# Altium schematic sheet Master.SchDoc
size A4; SheetNumber: 2; SheetTotal: 7
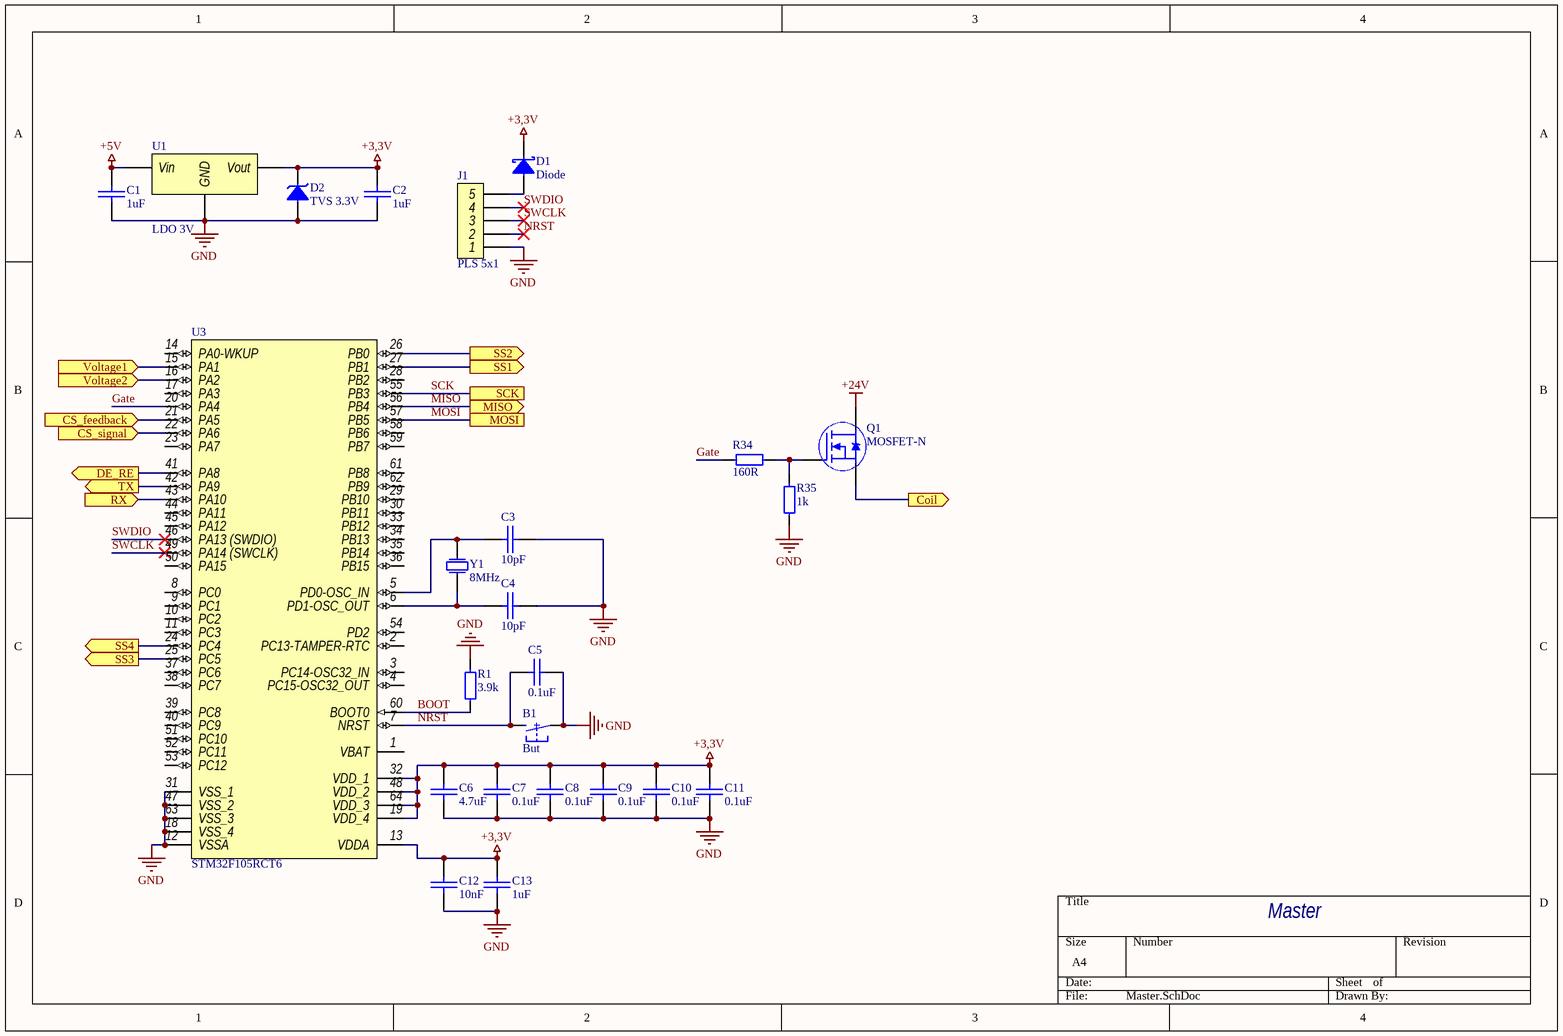
[diagram p0: Master.SchDoc]

## Parts
B1  But  [BUTTON 6x3.5]
C1  1uF  [0603 Capicator]
C2  1uF  [0603 Capicator]
C3  10pF  [0603 Capicator]
C4  10pF  [0603 Capicator]
C5  0.1uF  [0603 Capicator]
C6  4.7uF  [0603 Capicator]
C7  0.1uF  [0603 Capicator]
C8  0.1uF  [0603 Capicator]
C9  0.1uF  [0603 Capicator]
C10  0.1uF  [0603 Capicator]
C11  0.1uF  [0603 Capicator]
C12  10nF  [0603 Capicator]
C13  1uF  [0603 Capicator]
D1  Diode  [sod-123]
D2  TVS 3.3V  [DO-216AA]
J1  PLS 5x1  [PLS 5x1]
Q1  MOSFET-N  [SOT-23]
R1  3.9k  [0603 Resistor]
R34  160R  [0603 Resistor]
R35  1k  [0603 Resistor]
U1  LDO 3V  [SOT-23]
U3  STM32F105RCT6  [LQFP64]
Y1  8MHz  [NX5032GA]

## Ports
Coil (out), CS_feedback (in), CS_signal (in), DE_RE (out), MISO (out), MOSI, RX (in), SCK, SS1 (out), SS2 (out), SS3 (out), SS4 (out), TX (out), Voltage1 (in), Voltage2 (in)

## Nets
+3,3V: C2.2 C6.2 C7.2 C8.2 C9.2 C10.2 C11.2 C12.2 C13.2 D1.2 D2.2 U1.2(Vout) U3.13(VDDA) U3.19(VDD_4) U3.32(VDD_1) U3.48(VDD_2) U3.64(VDD_3)
+5V: C1.2 U1.3(Vin)
+24V: Q1.3(Drain)
GND: B1.1 C1.1 C2.1 C3.2 C4.2 C5.2 C6.1 C7.1 C8.1 C9.1 C10.1 C11.1 C12.1 C13.1 D2.1 J1.1 R1.2 R35.1 U1.1(GND) U3.12(VSSA) U3.18(VSS_4) U3.31(VSS_1) U3.47(VSS_2) U3.63(VSS_3)
BOOT: R1.1 U3.60(BOOT0)
Coil: Q1.2(Source) ; port Coil
CS_feedback: U3.21(PA5) ; port CS_feedback
CS_signal: U3.22(PA6) ; port CS_signal
DE_RE: U3.41(PA8) ; port DE_RE
Gate: R34.1 U3.20(PA4)
MISO: U3.56(PB4) ; port MISO
MOSI: U3.57(PB5) ; port MOSI
NRST: B1.2 C5.1 J1.2 U3.7(NRST)
RX: U3.43(PA10) ; port RX
SCK: U3.55(PB3) ; port SCK
SS1: U3.27(PB1) ; port SS1
SS2: U3.26(PB0) ; port SS2
SS3: U3.25(PC5) ; port SS3
SS4: U3.24(PC4) ; port SS4
SWCLK: J1.3 U3.49(PA14_(SWCLK))
SWDIO: J1.4 U3.46(PA13_(SWDIO))
TX: U3.42(PA9) ; port TX
Voltage1: U3.15(PA1) ; port Voltage1
Voltage2: U3.16(PA2) ; port Voltage2
NetC3_1: C3.1 U3.5(PD0-OSC_IN) Y1.2
NetC4_1: C4.1 U3.6(PD1-OSC_OUT) Y1.1
NetD1_1: D1.1 J1.5
NetQ1_1: Q1.1(Gate) R34.2 R35.2

Not connected (* = marked no-connect by the designer): U3 1(VBAT) 2(PC13-TAMPER-RTC) 3(PC14-OSC32_IN) 4(PC15-OSC32_OUT) 8(PC0) 9(PC1) 10(PC2) 11(PC3) 14(PA0-WKUP) 17(PA3) 23(PA7) 28(PB2) 29(PB10) 30(PB11) 33(PB12) 34(PB13) 35(PB14) 36(PB15) 37(PC6) 38(PC7) 39(PC8) 40(PC9) 44(PA11) 45(PA12) 50(PA15) 51(PC10) 52(PC11) 53(PC12) 54(PD2) 58(PB6) 59(PB7) 61(PB8) 62(PB9)

## Notes on the sheet
- Master

## Library data of the parts
B1 = Button 2 Conn: Button 2 Conn SMD; Part Number: L-KLS7-TS3608-5.0-180; Manufacturer: KLS electronic co ltd; Type: Button; ComponentLink1Description: Chip&Dip; ComponentLink1URL: https://www.chipdip.ru/product/kls7-ts3608-5.0-180-td-02xa
C1 C2 C13 = Cap 1uF (0603): 1uF X5R 25V 10% 0603; Manufacturer: Murata Manufacturing; Part Number: GRM188R61E105KAADD; Type: Capacitor; ComponentLink1Description: Chip&Dip; ComponentLink1URL: https://www.chipdip.ru/product/grm188r61e105k
C3 C4 = Cap 10pF (0603): 10pF NP0 50V 5% 0603; Manufacturer: Murata Manufacturing; Part Number: GRM1885C1H100JA01D; Type: Capacitor; ComponentLink1Description: Chip&Dip; ComponentLink1URL: https://www.chipdip.ru/product/grm1885c1h100j
C5 C7-C11 = Cap 0.1uF (0603): 0.1uF X7R 16V 10% 0603; Manufacturer: Murata Manufacturing; Part Number: GRM188R71C104KA01D; Type: Capacitor; ComponentLink1Description: Chip&Dip; ComponentLink1URL: https://www.chipdip.ru/product/grm188r71c104ka01d
C6 = Cap 4.7uF (0603): 4.7uF X5R 25V 10% 0603; Manufacturer: Murata Manufacturing; Part Number: GRM188R61E475KE11D; Type: Capacitor; ComponentLink1Description: Chip&Dip; ComponentLink1URL: https://www.chipdip.ru/product0/9000348448
C12 = Cap 10nF (0603): 10nF X7R  100V 10% 0603; Manufacturer: Murata Manufacturing; Part Number: GRM188R72A103KA01D; Type: Capacitor; ComponentLink1Description: Chip&Dip; ComponentLink1URL: https://www.chipdip.ru/product/grm188r72a103ka01d
D1 = Diode Schottky (SOD-123): 0.5 A, Low Forward Voltage less than 385 mV, 400 mW Power Dissipation Package; Part Number: MBR0520L; Manufacturer: ON Semiconductor; Type: Diode; ComponentLink1Description: DataSheet; ComponentLink1URL: http://www.farnell.com/datasheets/1875336.pdf; ComponentLink2Description: Chip&Dip; ComponentLink2URL: https://www.chipdip.ru/product/mbr0520l
D2 = TVS Diode 3.3V [SM2T]: High peak pulse power: 200 W (10/1000 μs); Part Number: SM2T3V3A; Manufacturer: STMicroelectronics; Type: Diode; ComponentLink1Description: DataSheet; ComponentLink1URL: https://www.st.com/resource/en/datasheet/sm2t3v3a.pdf; ComponentLink2Description: Chip&Dip; ComponentLink2URL: https://www.chipdip.ru/product0/8283670575
J1 = Conn 5 (PLS): Header, 5-Pin
Q1 = MOSFET-N [IRLML]: VDS 30V,  VGS Max ± 20V, RDS 27-40mΩ,; Part Number: IRLML0030TRPBF; Manufacturer: Infineon Technologies; Type: Transistor; ComponentLink1Description: DataSheet; ComponentLink1URL: https://static.chipdip.ru/lib/300/DOC000300382.pdf; ComponentLink2Description: Chip&Dip; ComponentLink2URL: https://www.chipdip.ru/product/irlml0030trpbf
R1 = Res 3.9k (0603): 0.1W 0603 3.9k, 1%; Part Number: RC0603FR-073K9L; Manufacturer: Taiwan; Type: Resistor; ComponentLink1Description: Chip&Dip; ComponentLink1URL: https://www.chipdip.ru/product0/9000079726
R34 = Res 160R (0603): 0.1W 0603 160R, 1%; Part Number: RC0603FR-07160RL; Manufacturer: Taiwan; Type: Resistor; ComponentLink1Description: Chip&Dip; ComponentLink1URL: https://www.chipdip.ru/product/0.1w-0603-160-om-1
R35 = Res 1k (0603): 0.1W 0603 1k, 1%; Part Number: RC0603FR-071KL; Manufacturer: Taiwan; Type: Resistor; ComponentLink1Description: Chip&Dip; ComponentLink1URL: https://www.chipdip.ru/product0/9000079676
U1 = LDO 3,3V [MCP]: MCP1702 Low Dropout Voltage Regulator. The input operating range is specifiedfrom 2.7V to 13.2V; Part Number: MCP1702T-3002E/CB; Manufacturer: Microchip; ComponentLink1Description: DataSheet; ComponentLink1URL: https://static.chipdip.ru/lib/986/DOC003986671.pdf; ComponentLink2Description: Chip&Dip; ComponentLink2URL: https://www.chipdip.ru/product/mcp1702t-3002e-cb-microchip
U3 = STM32F105RCT6: MCU ARM 256KB FLASH MEM 64-LQFP; Manufacturer: STMicroelectronics; Part Number: STM32F105RCT6; ComponentLink1Description: DataSheet; ComponentLink1URL: https://static.chipdip.ru/lib/375/DOC011375072.pdf; ComponentLink2Description: Chip&Dip; ComponentLink2URL: https://www.chipdip.ru/product/stm32f105rct6; Type: IC
Y1 = Crystal 8MHz: Crystal NX5032GA; Manufacturer: Nihon Dempa Kogio (NDK); Part Number: NX5032GA-8MHz; Type: Crystal; ComponentLink1Description: Chip&Dip; ComponentLink1URL: https://www.chipdip.ru/product0/9000523954